# EAGLE design Main (EAGLE 9.6.1)
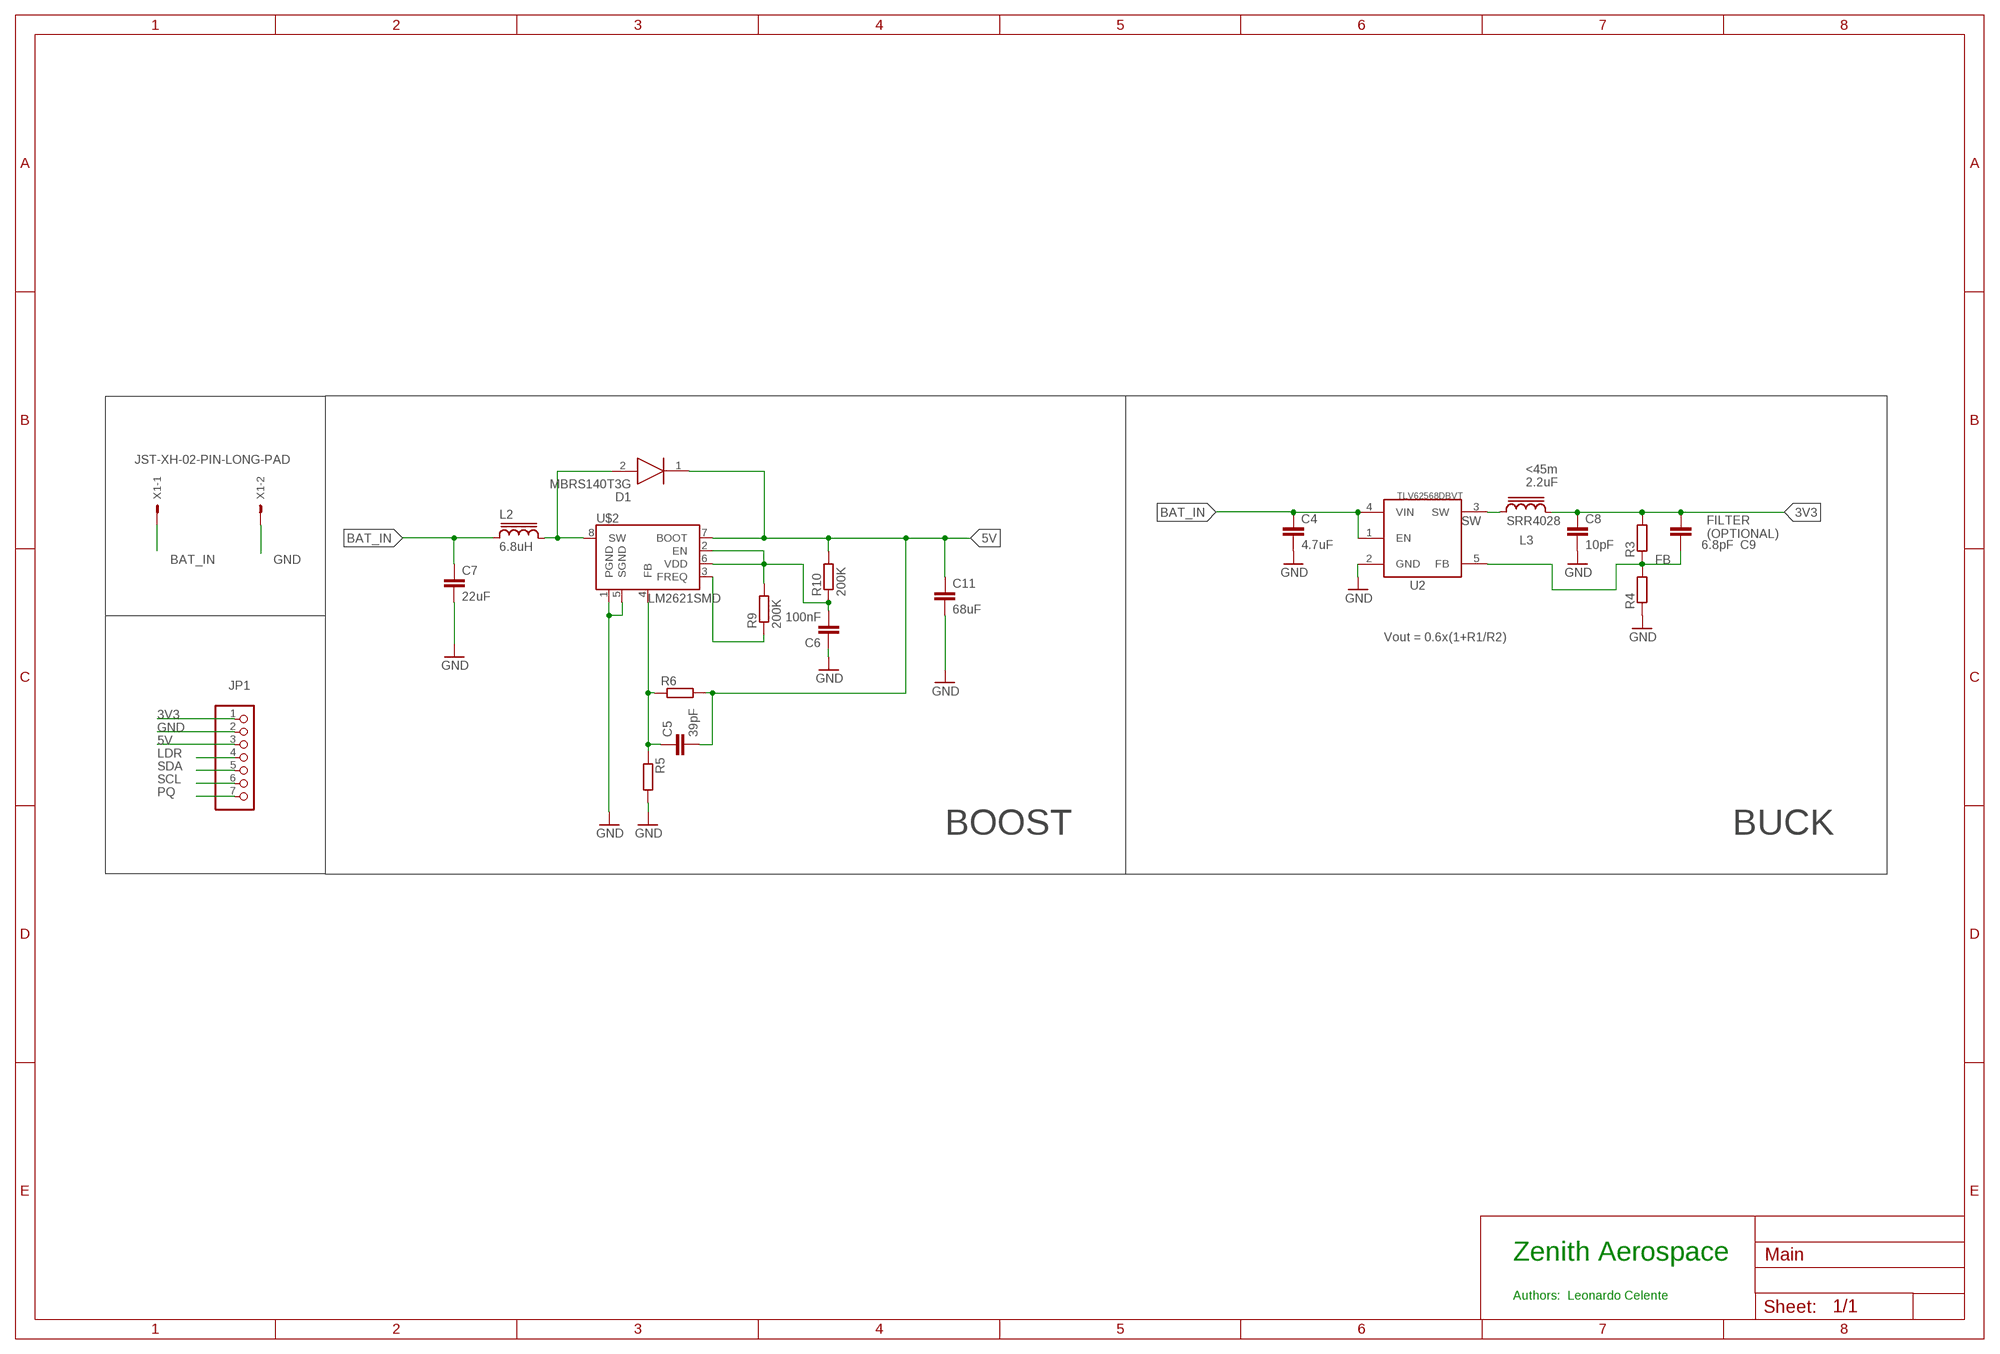
[diagram p0: schematic, sheet 1]

## Parts
C4  4.7uF  C-EUC0805  [C0805]
C5  39pF  C-EUC0805  [C0805]
C6  100nF  C-EUC0805  [C0805]
C7  22uF  C-EUC1210  [C1210]
C8  10pF  C-EUC0805  [C0805]
C9  6.8pF  C-EUC0805  [C0805]
C11  68uF  C-EUC1210  [C1210]
D1  MBRS140T3G  [DIOM5436X247N]
JP1  PINHD-1X7  [1X07]
L2  6.8uH  SRR1280  [SRR1280]
L3  SRR4028  [SRR4028]
R3  R-EU_R0805  [R0805]
R4  R-EU_R0805  [R0805]
R5  R-EU_R0805  [R0805]
R6  R-EU_R0805  [R0805]
R9  200K  R-EU_R0805  [R0805]
R10  200K  R-EU_R0805  [R0805]
U2  TLV62568DBVT  [SOT95P280X145-5N]
U$2  LM2621SMD  [MSOP-8]
X1  JST-XH-02-PIN-LONG-PAD  [JST-XH-02-PACKAGE-LONG-PAD]

## Nets
3V3: C8.1 C9.1 JP1.1 L3.2 R3.2
5V: C5.2 C11.1 D1.1(K) JP1.3 R6.2 R10.2 U$2.7(BOOT)
BAT_IN: C4.1 C7.1 L2.1 U2.1(EN) U2.4(VIN) X1.1
FB: C9.2 R3.1 R4.2 U2.5(FB)
GND: C4.2 C6.1 C7.2 C8.2 C11.2 JP1.2 R4.1 R5.2 U2.2(GND) U$2.1(PGND) U$2.5(SGND) X1.2
LDR: JP1.4
N$6: C5.1 R5.1 R6.1 U$2.4(FB)
N$7: D1.2(A) L2.2 U$2.8(SW)
N$8: C6.2 R9.2 R10.1 U$2.2(EN) U$2.6(VDD)
N$9: R9.1 U$2.3(FREQ)
PQ: JP1.7
SCL: JP1.6
SDA: JP1.5
SW: L3.1 U2.3(SW)

## Notes on the sheet
- FILTER
  (OPTIONAL)
- Vout = 0.6x(1+R1/R2)
- BOOST | BUCK
- Zenith Aerospace
- Authors:  Leonardo Celente

## Library data of the parts
C4-C9 C11 = rcl:C-EU: CAPACITOR, European symbol; SPICEPREFIX: C
D1 = MBRS140T3G:MBRS140T3G: Source: Datasheet <http://www.onsemi.com/pub/Collateral/MBRS140T3-D.PDF>; ALLIED_NUMBER: 70099505; ALLIED_PRICE/STOCK: http://www.alliedelec.com/on-semiconductor-mbrs140t3g/70099505/; ARROW_PART_NUMBER: MBRS140T3G; ARROW_PRICE/STOCK: https://www.arrow.com/en/products/mbrs140t3g/on-semiconductor; HEIGHT: 2.47mm; MANUFACTURER_NAME: ON Semiconductor; MANUFACTURER_PART_NUMBER: MBRS140T3G; RS_PART_NUMBER: 5452074P; RS_PRICE/STOCK: http://uk.rs-online.com/web/p/products/5452074P
JP1 = pinhead:PINHD-1X7: PIN HEADER
L2 = inductor-bourns:SRR1280: POWER INDUCTOR
L3 = inductor-bourns:SRR4028: POWER INDUCTOR; DCR: <45m; L: 2.2uF
R3-R6 R9 R10 = rcl:R-EU_: RESISTOR, European symbol; SPICEPREFIX: R
U2 = TLV62568:TLV62568DBVT: TLV625681-A High EfficiencySynchronousBuck Converterin SOT Package This is not the P variant that has the Power Good pin (SOT-23-6)
U$2 = SparkFun-PowerIC:LM2621: Step-up switching regulator IC
X1 = JST-XH-Zenith:JST-XH-02-PIN: JST XH Connector 2 Pin Wire to board connector. Pitch: 2,54 mm, (0.100") Number of pins: 2 Created by Rembrandt Electronics www.rembrandtelectronics.com

## Board
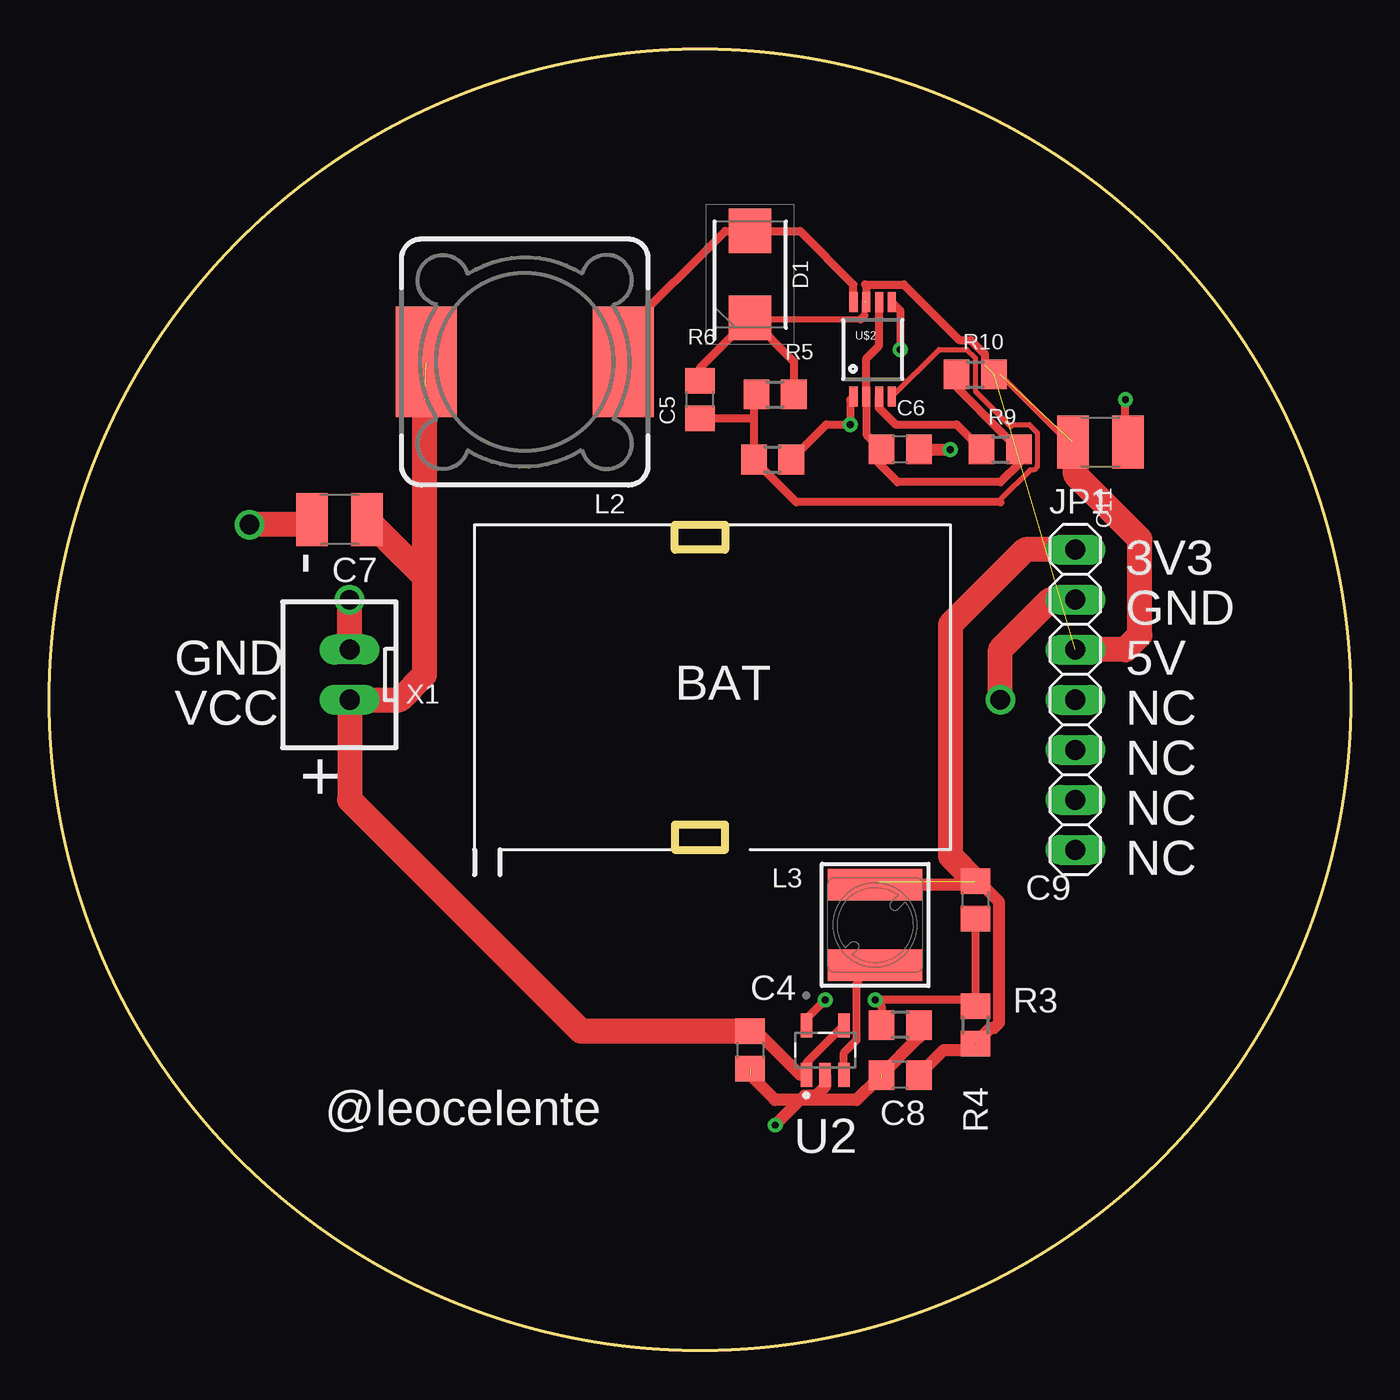
[diagram p1: board, top side]
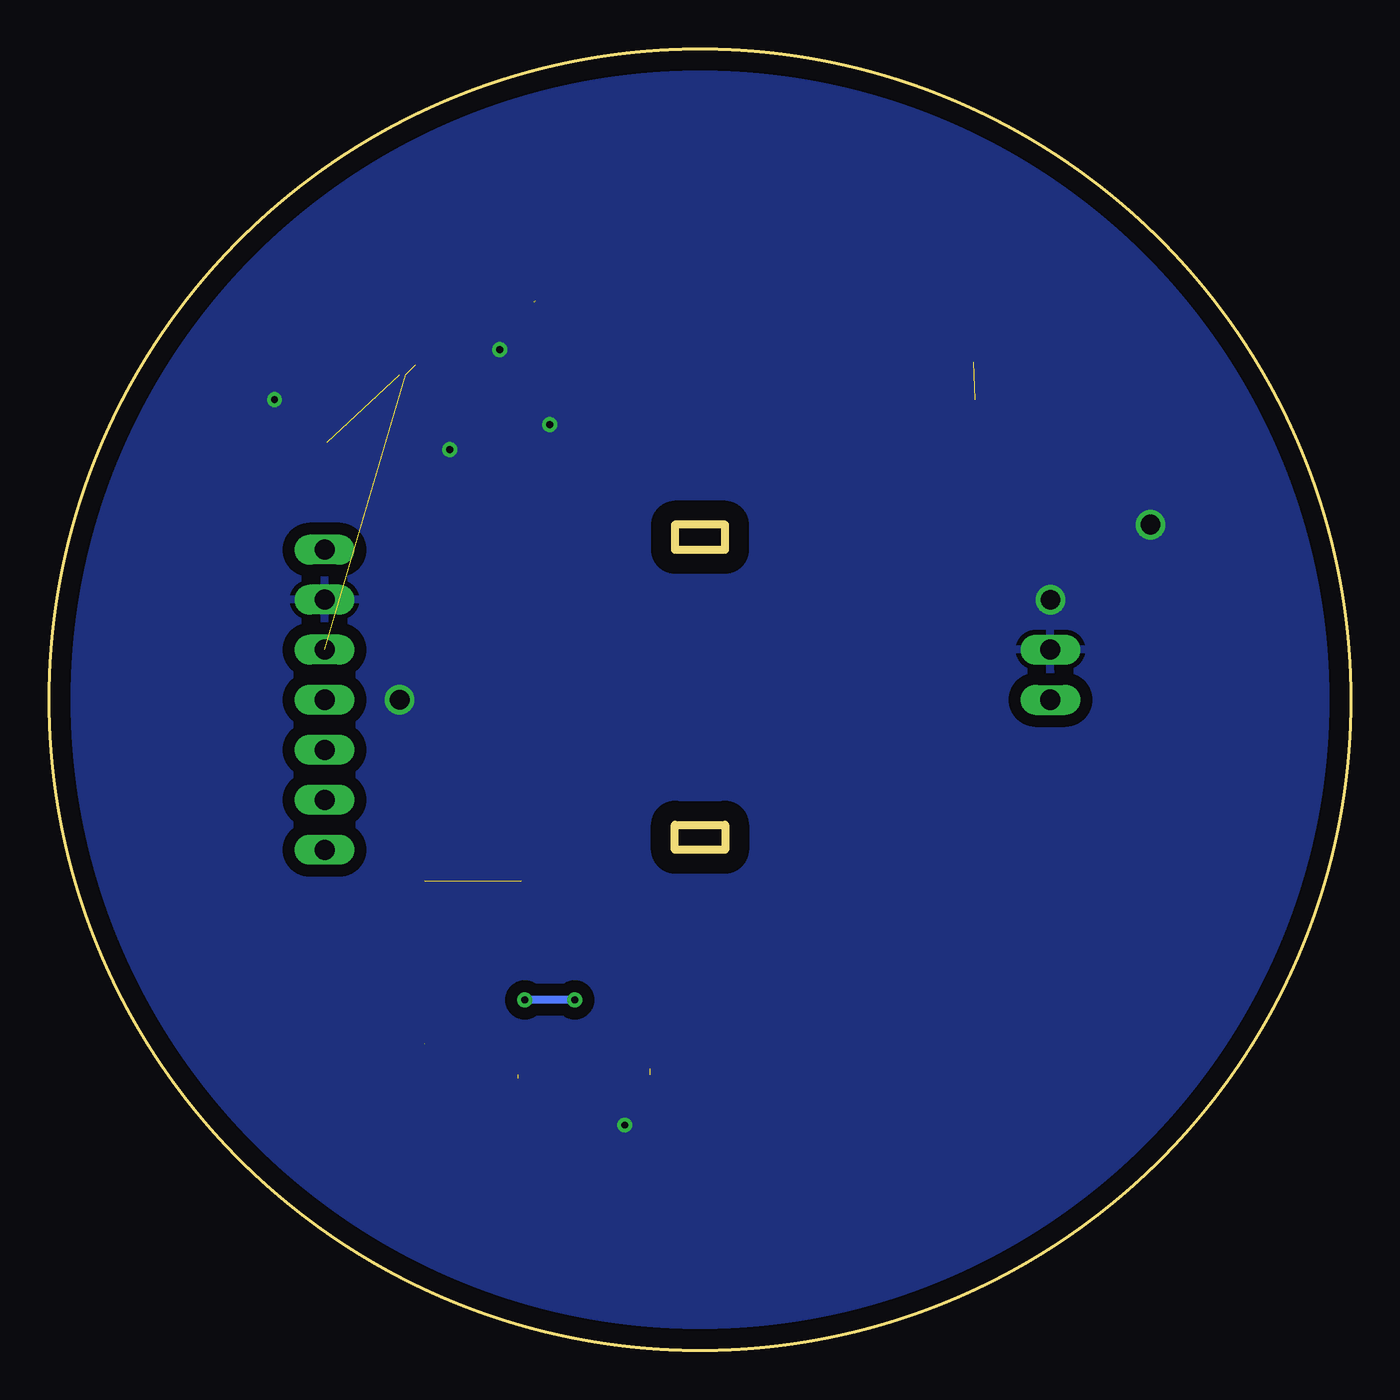
[diagram p2: board, bottom side, seen from below]

Size 66.04 x 66.04 mm. Coordinates in mm from the lower left corner, seen from the top.
Outline: 31.75,26.67 31.75,25.4 34.29,25.4 34.29,26.67 31.75,26.67
Outline: 31.75,40.64 31.75,41.91 34.29,41.91 34.29,40.64 31.75,40.64
Outline: circle at 33.02,33.02 radius 33.02
Copper layers (1*16): Top 0.035mm / dielectric 1.5mm / Bottom 0.035mm
Design rules "default": minimum track width 6mil, minimum drill 0.35mm, track to track 6mil, track to pad 6mil, pad to pad 6mil, via to via 6mil, smd to smd 6mil, copper to edge 40mil, drill to drill 6mil, minimum pad ring 10mil, minimum via ring 8mil, stop-mask expansion 4mil, vias tented up to drill 0mil, thermal gap 10mil

### Footprints (pad centres in the part's own frame; a part is rotated, then mirrored left to right if it is on the bottom)
C0805 = smd 1.3 x 1.5: 1 -0.95,0; 2 0.95,0
C1210 = smd 1.6 x 2.7: 1 -1.4,0; 2 1.4,0
DIOM5436X247N = smd 2.25 x 2.15: 1 -2.2,0; 2 2.2,0
1X07 = drill 1.016 long: 1 -7.62,0; 2 -5.08,0; 3 -2.54,0; 4 0,0; 5 2.54,0; 6 5.08,0; 7 7.62,0
SRR1280 = smd 5.6 x 3.1: 1 0.635,5; 2 0.635,-5
SRR4028 = smd 4.8 x 1.6: 1 0,2.05; 2 0,-2.05
R0805 = smd 1.3 x 1.5: 1 -0.95,0; 2 0.95,0
SOT95P280X145-5N = smd 0.59 x 1.21: 1 -0.95,-1.255; 2 0,-1.255; 3 0.95,-1.255; 4 0.95,1.255; 5 -0.95,1.255
MSOP-8 = smd 0.41 x 1.02: 1 -0.975,-2.4; 2 -0.325,-2.4; 3 0.325,-2.4; 4 0.975,-2.4; 5 0.975,2.4; 6 0.325,2.4; 7 -0.325,2.4; 8 -0.975,2.4
JST-XH-02-PACKAGE-LONG-PAD = drill 1.016 long: 1 -1.27,0; 2 1.27,0

### Placement (x,y rotation side)
C4  35.56,15.24 270 top
C5  33.02,48.26 90 top
C6  43.18,45.72 180 top
C7  14.73,42.16 180 top
C8  43.18,13.97 180 top
C9  46.99,22.86 270 top
C11  53.34,46.1 0 top
D1  35.56,54.61 90 top
JP1  52.07,33.02 270 top
L2  24.13,49.53 90 top
L3  41.91,21.59 180 top
R3  46.99,16.51 270 top
R4  43.18,16.51 180 top
R5  36.7,45.21 0 top
R6  36.83,48.51 0 top
R9  48.26,45.72 0 top
R10  46.99,49.53 0 top
U2  39.37,15.24 0 top
U$2  41.78,50.8 0 top
X1  15.24,34.29 90 top

### Tracks (layer width: path | path; a pad name or v marks a point on that pad's centre or on a via)
3V3  (2 unrouted)
  Top 0.152: L3.2 42.08,23.81 | R3.2 46.99,15.99 | 46.99,23.63 46.98,23.64
  Top 0.406: C9.1 46.99,24.13 | R3.2 46.99,15.24
  Top 0.61: C8.1 45.4,15.24 46.99,15.24 | L3.2 46.98,23.64 | R3.2 47.78,16.35 47.93,16.35 48.2,16.62 48.2,22.75 47.31,23.63 46.99,23.63
  Top 1.27: JP1.1 49.53,40.64 45.72,36.83 45.72,25.08 C9.1
5V  (4 unrouted)
  Top 0.254: 52.07,45.72 48.26,49.53
  Top 0.305: 41.37,52.54 41.37,53.25 | 35.64,52.33 41.16,52.33
  Top 0.406: U$2.7 41.46,54.05 41.4,54.1 43.37,54.1 46.19,51.28 46.77,51.28 47.47,50.58 47.47,50 | 41.16,52.33 41.37,52.54 | D1.1 35.64,52.33 | C5.2 33.02,49.87 D1.1 | D1.1 37.78,50.19 R6.2
  Top 1.27: JP1.3 54.61,35.56 55.34,36.29 55.34,41.18 52.07,44.45 52.07,45.72
BAT_IN  (1 unrouted)
  Top 0.152: 38.42,14.6 U2.1 38.1,13.98
  Top 0.406: U2.4 38.42,14.6 | 18.93,39.37 19.05,39.37
  Top 0.61: C4.1 35.9,16.19 38.1,13.98
  Top 1.27: C4.1 26.99,16.19 15.24,27.94 X1.1 17.78,33.02 19.05,34.29 19.05,39.37 19.05,48.26 | C7.1 18.93,39.37
FB  (via drill 0.35)
  Top 0.152: 42.27,16.87 R4.2
  Top 0.406: R4.2 42.23,17.46 v41.91,17.78 46.67,17.78 R3.1 C9.2 | U2.5 38.42,16.83 v39.37,17.78
  Bottom 0.406: v39.37,17.78 v41.91,17.78
GND  (via drill 0.35, 1)  (2 unrouted)
  Top 0.152: 42.25,13.81 42.07,13.81 | 44.13,15.87 R4.1
  Top 0.406: U$2.5 43.18,52.78 v43.18,50.8 | U$2.1 40.64,48.23 v40.64,46.99 39.43,46.99 R5.2 | C7.2 13.08,41.91 | C11.2 54.61,46.23 v54.61,48.26
  Top 0.61: 42.07,13.81 40.96,12.7 38.1,12.7 | 35.56,13.97 36.83,12.7 38.1,12.7 | C8.2 44.13,15.87 | 38.1,12.7 v36.83,11.43 | C6.1 v45.72,45.72 | 38.1,12.7 38.32,12.92 38.9,12.92 39.37,13.39 U2.2
  Top 1.27: X1.2 v15.24,38.1 | 13.08,41.91 v10.16,41.91 | v48.26,33.02 48.26,35.56 50.8,38.1
  pour Bottom (isolate 0.61): -29.21,77.47 -29.21,-11.43 -12.7,-27.94 109.22,-27.94 110.49,-26.67 110.49,68.58 93.98,85.09 -21.59,85.09
N$6
  Top 0.254: U$2.4 45.16,50.8 46.57,50.8 46.99,50.38 46.99,48.69 48.69,46.99 | 48.69,46.99 48.81,46.86 | 48.26,43.05 48.26,43.18 49.77,44.69 49.98,44.69 50.14,44.85 50.14,46.59 49.74,46.99 48.69,46.99
  Top 0.406: 48.26,43.05 37.91,43.05 36.65,44.31 36.65,44.32 R5.1 35.75,47.31 | C5.1 35.75,47.31 | 35.75,48.39 35.75,47.31
  Top 0.508: 35.75,48.39 R6.1
N$7
  Top 0.406: L2.2 29.13,51.65 34.29,56.81 D1.2 38.1,56.81 40.81,54.1 U$2.8
N$8
  Top 0.406: U$2.6 42.11,51 41.46,50.35 U$2.2 41.46,46.49 42.07,45.88 | 48.9,45.72 R9.2 | 42.07,45.88 C6.2 | R9.2 49.21,45.02 48.26,44.07 43.05,44.07 42.07,45.05 42.07,45.88 | R9.2 48.32,46.61 48.32,46.62 46.04,48.89 R10.1
N$9
  Top 0.406: U$2.3 42.07,48.36 42.07,47.87 42.95,46.99 46.04,46.99 R9.1
SW
  Top 0.152: 41.03,18.66 L3.1
  Top 0.406: U2.3 40.32,15.09 40.97,15.74 40.97,18.6 41.03,18.66

### Text on the board
tNames: - | 3V3 | GND | GND | 5V | BAT | VCC | NC | NC | + | NC | NC | @leocelente